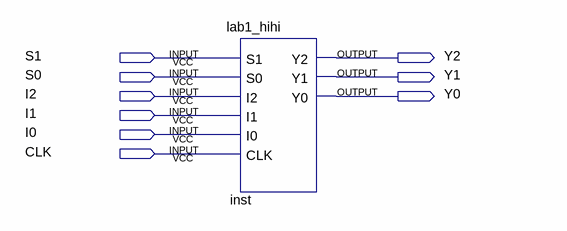
[diagram p0: schematic sheet]
// Quartus schematic Block5.bdf as structural Verilog: 1 symbols, 9 pins
module Block5 (
  input  S1,
  input  S0,
  input  I2,
  input  I1,
  input  I0,
  input  CLK,
  output Y2,
  output Y1,
  output Y0
);

  lab1_hihi inst (.S1(S1), .S0(S0), .I2(I2), .I1(I1), .I0(I0), .CLK(CLK), .Y2(Y2), .Y1(Y1), .Y0(Y0));
endmodule
